# Altium schematic sheet partA.SchDoc
size A4
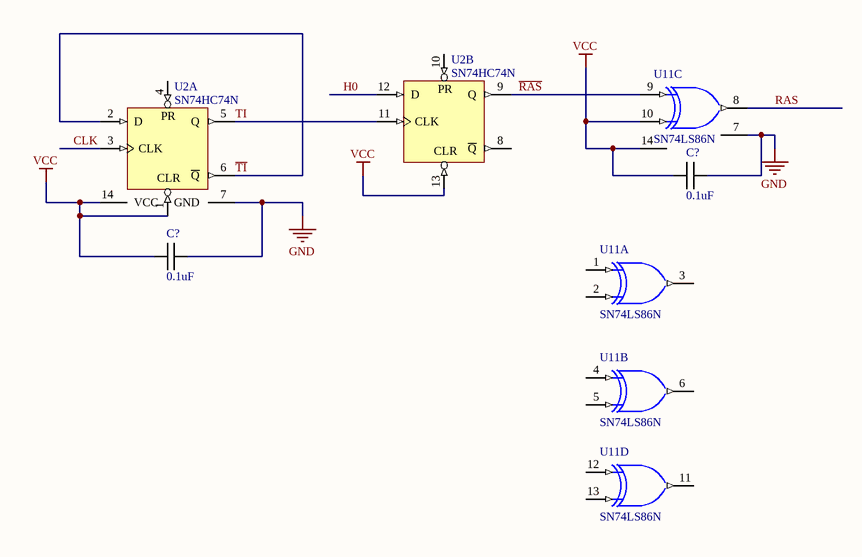
[diagram p0: partA.SchDoc]

## Parts
(Parts that share a designator on the sheet are numbered #1, #2 ... from top to bottom, then left to right.)
C?#1  0.1uF  [SMD 0603]
C?#2  0.1uF  [SMD 0603]
U2  SN74HC74N  [N014]  (parts A,B of 2)
U11  SN74LS86N  [646-06]  (parts A,B,C,D of 4)

## Nets
GND: C?#1.2 C?#2.2 U2.7(GND) U11.7(GND)
VCC: C?#1.1 C?#2.1 U2.1(CLR) U2.13(CLR) U2.14(VCC) U11.10(B) U11.14(VCC)
CLK: U2.3(CLK)
H0: U2.12(D)
~{RAS}: U2.9(Q) U11.9(A)
RAS: U11.8(Y)
~{TI}: U2.2(D) U2.6(~{Q})
TI: U2.5(Q) U2.11(CLK)

Not connected (* = marked no-connect by the designer): U2 4(PR) 8(~{Q}) 10(PR); U11 1(A) 2(B) 3(Y) 4(A) 5(B) 6(Y) 11(Y) 12(A) 13(B)

## Library data of the parts
C?#1 C?#2 = Capasitor: Value: 0.1uF
U2 = SN74HC74N: Dual D-Type Positive-Edge-Triggered Flip-Flop with Clear and Preset; Published: 8-Jun-2000; LatestRevisionDate: 04-Mar-2005; LatestRevisionNote: Stylized 3D Model Added.; DatasheetVersion: May-1997; PackageVersion: Oct-1995; PackageReference: N014; Publisher: Altium Limited; PackageDescription: DIP; 14 Leads; Row Spacing 7.62 mm; Pitch 2.54 mm; ComponentLink1Description: Manufacturer Link; ComponentLink1URL: http://www.ti.com/; ComponentLink2Description: Datasheet; ComponentLink2URL: http://www-s.ti.com/sc/ds/sn74hc74.pdf
U11 = SN74LS86N: Quad 2-Input XOR Gate; ComponentAvailability: Not for New Design; Published: 15-Apr-2002; DatasheetVersion: Dec-1999; PackageVersion: 1995; PackageReference: 646-06; Publisher: Altium Limited; PackageDescription: DIP; 14 Leads; Row Spacing 7.62 mm; Pitch 2.54 mm; ComponentLink1Description: Manufacturer Link; ComponentLink1URL: http://www.onsemi.com/; ComponentLink2Description: Datasheet; ComponentLink2URL: http://www.onsemi.com/pub/Collateral/SN74LS86-D.PDF